# Altium schematic sheet Fujin_Main.SchDoc
size A4; SheetNumber: 1; SheetTotal: 4
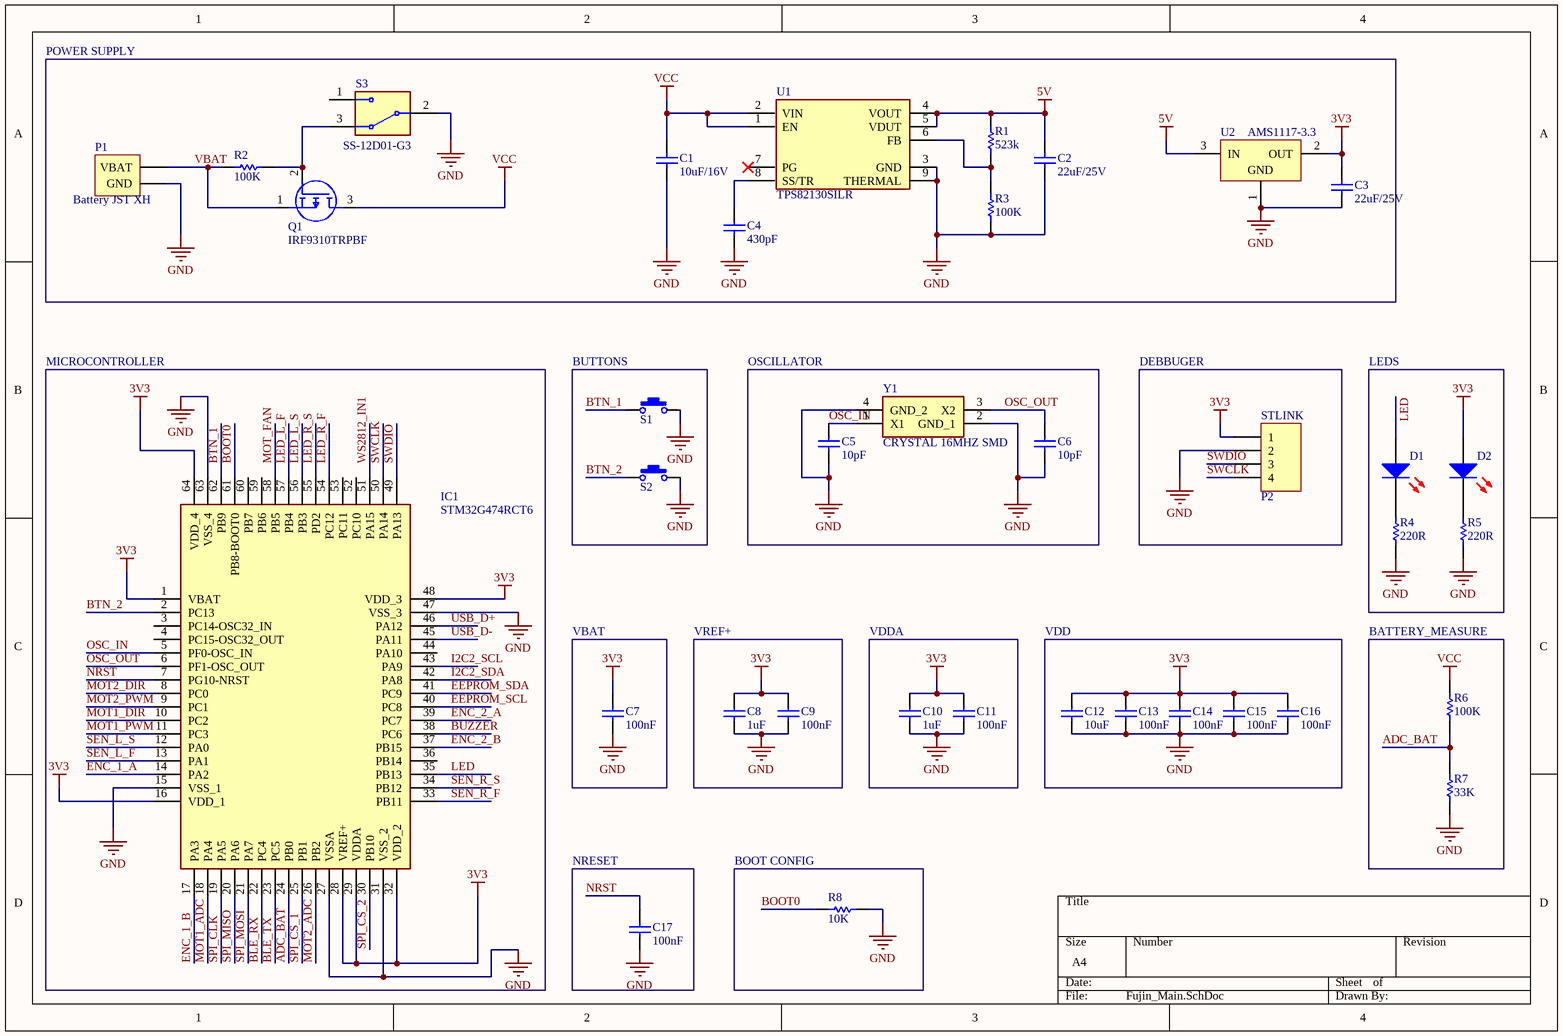
[diagram p0: Fujin_Main.SchDoc]

## Parts
C1  10uF/16V  [CAPACITOR-0805]
C2  22uF/25V  [CAPACITOR-0805]
C3  22uF/25V  [CAPACITOR-0805]
C4  430pF  [Capacitor-0603]
C5  10pF  [CAP 0402]
C6  10pF  [CAP 0402]
C7  100nF  [CAP 0402]
C8  1uF  [Capacitor-0603]
C9  100nF  [CAP 0402]
C10  1uF  [Capacitor-0603]
C11  100nF  [CAP 0402]
C12  10uF  [CAPACITOR-0805]
C13  100nF  [CAP 0402]
C14  100nF  [CAP 0402]
C15  100nF  [CAP 0402]
C16  100nF  [CAP 0402]
C17  100nF  [CAP 0402]
D1  LED RED 0603  [LED 0603]  (value not drawn)
D2  LED RED 0603  [LED 0603]  (value not drawn)
IC1  STM32G474RCT6  [QFP50P1200X1200X160-64N]
P1  Battery JST XH  [JST XH 1x2 Straight]
P2  Header 1x4  [HDR MALE 1x4]  (value not drawn)
Q1  IRF9310TRPBF  [IRF9310TRPBF]
R1  523k  [RESISTOR 0603]
R2  100K  [RESISTOR 0603]
R3  100K  [RESISTOR 0603]
R4  220R  [RESISTOR 0603]
R5  220R  [RESISTOR 0603]
R6  100K  [RESISTOR 0603]
R7  33K  [RESISTOR 0603]
R8  10K  [RESISTOR 0402]
S1  SPST-NO  [B3U-1000P]  (value not drawn)
S2  SPST-NO  [B3U-1000P]  (value not drawn)
S3  SS-12D01-G3  [DEALON SS-12D01-G3]
U1  TPS82130SILR  [SIL0008D]
U2  AMS1117-3.3  [SOT223 - AMS1117]
Y1  CRYSTAL 16MHZ SMD  [ABM10W240000MHZ8K1ZT3]

## Blocks framed on the sheet
POWER SUPPLY: C1-C4 P1 Q1 R1-R3 S3 U1 U2
MICROCONTROLLER: IC1
BUTTONS: S1 S2
OSCILLATOR: C5 C6 Y1
LEDS: D1 D2 R4 R5
VBAT: C7
VREF+: C8 C9
VDDA: C10 C11
VDD: C12-C16
BATTERY_MEASURE: R6 R7
NRESET: C17
BOOT CONFIG: R8

## Nets
3V3: C3.2 C7.2 C8.2 C9.2 C10.2 C11.2 C12.2 C13.2 C14.2 C15.2 C16.2 D2.1(A) IC1.1(VBAT) IC1.16(VDD_1) IC1.28(VREF+) IC1.29(VDDA) IC1.32(VDD_2) IC1.48(VDD_3) IC1.64(VDD_4) P2.1 U2.2(OUT)
5V: C2.2 R1.2 U1.4(VOUT) U1.5(VDUT) U2.3(IN)
GND: C1.1 C2.1 C3.1 C4.1 C5.1 C6.1 C7.1 C8.1 C9.1 C10.1 C11.1 C12.1 C13.1 C14.1 C15.1 C16.1 C17.1 IC1.15(VSS_1) IC1.27(VSSA) IC1.31(VSS_2) IC1.47(VSS_3) IC1.63(VSS_4) P1.2(GND) P2.2 R3.1 R4.1 R5.1 R7.1 R8.2 S1.2 S2.2 S3.2(COM) U1.3(GND) U1.9(THERMAL) U2.1(GND) Y1.2(GND_1) Y1.4(GND_2)
VCC: C1.2 Q1.3(D) R6.2 U1.1(EN) U1.2(VIN)
ADC_BAT: IC1.24(PB0) R6.1 R7.2
BLE_RX: IC1.22(PC4)
BLE_TX: IC1.23(PC5)
BOOT0: IC1.61(PB8-BOOT0) R8.1
BTN_1: IC1.62(PB9) S1.1
BTN_2: IC1.2(PC13) S2.1
BUZZER: IC1.38(PC6)
EEPROM_SCL: IC1.40(PC8)
EEPROM_SDA: IC1.41(PC9)
ENC_1_A: IC1.14(PA2)
ENC_1_B: IC1.17(PA3)
ENC_2_A: IC1.39(PC7)
ENC_2_B: IC1.37(PB15)
I2C2_SCL: IC1.43(PA9)
I2C2_SDA: IC1.42(PA8)
LED: D1.1(A) IC1.35(PB13)
LED_L_F: IC1.57(PB4)
LED_L_S: IC1.56(PB3)
LED_R_F: IC1.54(PC12)
LED_R_S: IC1.55(PD2)
MOT1_ADC: IC1.18(PA4)
MOT1_DIR: IC1.10(PC2)
MOT1_PWM: IC1.11(PC3)
MOT2_ADC: IC1.26(PB2)
MOT2_DIR: IC1.8(PC0)
MOT2_PWM: IC1.9(PC1)
MOT_FAN: IC1.58(PB5)
NRST: C17.2 IC1.7(PG10-NRST)
OSC_IN: C5.2 IC1.5(PF0-OSC_IN) Y1.1(X1)
OSC_OUT: C6.2 IC1.6(PF1-OSC_OUT) Y1.3(X2)
SEN_L_F: IC1.13(PA1)
SEN_L_S: IC1.12(PA0)
SEN_R_F: IC1.33(PB11)
SEN_R_S: IC1.34(PB12)
SPI_CLK: IC1.19(PA5)
SPI_CS_1: IC1.25(PB1)
SPI_CS_2: IC1.30(PB10)
SPI_MISO: IC1.20(PA6)
SPI_MOSI: IC1.21(PA7)
SWCLK: IC1.50(PA14) P2.4
SWDIO: IC1.49(PA13) P2.3
USB_D+: IC1.46(PA12)
USB_D-: IC1.45(PA11)
VBAT: P1.1(VBAT) Q1.1(S) R2.1
WS2812_IN1: IC1.51(PA15)
NetC4_2: C4.2 U1.8(SS/TR)
NetD1_2: D1.2(K) R4.2
NetD2_2: D2.2(K) R5.2
NetQ1_2: Q1.2(G) R2.2 S3.3(NO)
NetR1_1: R1.1 R3.2 U1.6(FB)

Not connected (* = marked no-connect by the designer): IC1 3(PC14-OSC32_IN) 4(PC15-OSC32_OUT) 36(PB14) 44(PA10) 52(PC10) 53(PC11) 59(PB6) 60(PB7); S3 1(NC); U1 7(PG)*

## Notes on the sheet
- DEBBUGER
- (near P2) STLINK

## Library data of the parts
C1 C12 = CAP CER 10UF 16V X5R 0805: Manufacturer: AVX Corporation; Manufacturer Part Number: 0805YD106KAT2A; Capacitance: 10µF; Tolerance: ±10%; Supplier 1: Digi-Key; RoHS: RoHS Compliant; Category: Capacitors; Stock 1: 198871; Pricing 1: 1=0.18, 10=0.124, 25=0.0908, 50=0.0742, 100=0.0627, 250=0.05116, 500=0.0429, 1000=0.03795 (USD); Packaging: Cut Tape (CT); Part Status: Active; Voltage - Rated: 16V; Temperature Coefficient: X5R; Mounting Type: Surface Mount, MLCC; Operating Temperature: -55°C ~ 85°C; Applications: General Purpose; Ratings: -; Package / Case: 0805 (2012 Metric); Size / Dimension: 0.079" L x 0.049" W (2.01mm x 1.25mm); Height - Seated (Max): -; Thickness (Max): 0.055" (1.40mm); Lead Spacing: -; Features: -; Lead Style: -; ComponentLink1URL: http://datasheets.avx.com/cx5r.pdf; ComponentLink1Description: http://datasheets.avx.com/cx5r.pdf; Supplier Part Number 1: 478-5165-1-ND
C2 C3 = CAP CER 22UF 25V X5R 0805: Manufacturer: AVX Corporation; Manufacturer Part Number: 0805YD106KAT2A; Capacitance: 10µF; Tolerance: ±10%; Voltage - Rated: 16V; Supplier 1: Digi-Key; RoHS: RoHS Compliant; Category: Capacitors; Stock 1: 198871; Pricing 1: 1=0.18, 10=0.124, 25=0.0908, 50=0.0742, 100=0.0627, 250=0.05116, 500=0.0429, 1000=0.03795 (USD); Packaging: Cut Tape (CT); Part Status: Active; Temperature Coefficient: X5R; Mounting Type: Surface Mount, MLCC; Operating Temperature: -55°C ~ 85°C; Applications: General Purpose; Ratings: -; Package / Case: 0805 (2012 Metric); Size / Dimension: 0.079" L x 0.049" W (2.01mm x 1.25mm); Height - Seated (Max): -; Thickness (Max): 0.055" (1.40mm); Lead Spacing: -; Features: -; Lead Style: -; ComponentLink1URL: https://www.lcsc.com/product-detail/Multilayer-Ceramic-Capacitors-MLCC-SMD-SMT_Murata-Electronics-GRM21BR61E226ME44L_C86816.html; ComponentLink1Description: http://datasheets.avx.com/cx5r.pdf; Supplier Part Number 1: 478-5165-1-ND
C4 = CAP 430pF: Capacitor Cer 430pF; Manufacturer Part Number: IMP14925; Product Range: MCFY Series; Capacitance Tolerance: +80%, -20%; Dielectric Characteristic: Y5; Voltage Rating: 50; Capacitor Terminals: Radial Leaded; SVHC: No SVHC (15-Jun-2015); Supplier 1: Mult Comercial; Manufacturer: -; RoHS: YES; Stock 1: 115809; Pricing 1: 1=0.10 (BRL); Packaging: Each; Lead Spacing: 5; Operating Temperature Min: -25; Operating Temperature Max: 85; Capacitance Tolerance ±: +80%, -20%; Operating Temperature Range: -25°C to +85°C<!--FANDB--><div class="features-and-benefits-container"><div class="features-and-benefits-description"><span class="features-benefits-value">The MCFY series from Multicomp are radial leaded ceramic disc capacitors. The capacitance values ranges from 6800pF to 0.22?F.</span></div><div class="features-and-benefits-list"><ul class="features-and-benefits-list-list"><li class="features-and-benefits-list-item">Large capacitance in small size</li><li class="features-and-benefits-list-item">Rated voltage of 50V</li><li class="features-and-benefits-list-item">80%/-20% tolerance</li><li class="features-and-benefits-list-item">Operating temperature range -25°C to +85; ComponentLink1URL: http://loja.multcomercial.com.br/capacitor-ceramico-disco-100kpf-50v-104-100k-100nf-0-1uf-cod-1351.html; ComponentLink1Description: http://loja.multcomercial.com.br/capacitor-ceramico-disco-100kpf-50v-104-100k-100nf-0-1uf-cod-1351.html; Supplier Part Number 1: Capacitor Cerâmico Disco 100Kpf/50V (104/100K/100nF/0.1uF) cód. 1351
C5 C6 = CAP 10pF: Capacitor Cer 10pF; Manufacturer Part Number: IMP14925; Product Range: MCFY Series; Capacitance Tolerance: +80%, -20%; Dielectric Characteristic: Y5; Voltage Rating: 50; Capacitor Terminals: Radial Leaded; SVHC: No SVHC (15-Jun-2015); Supplier 1: Mult Comercial; Manufacturer: -; RoHS: YES; Stock 1: 115809; Pricing 1: 1=0.10 (BRL); Packaging: Each; Lead Spacing: 5; Operating Temperature Min: -25; Operating Temperature Max: 85; Capacitance Tolerance ±: +80%, -20%; Operating Temperature Range: -25°C to +85°C<!--FANDB--><div class="features-and-benefits-container"><div class="features-and-benefits-description"><span class="features-benefits-value">The MCFY series from Multicomp are radial leaded ceramic disc capacitors. The capacitance values ranges from 6800pF to 0.22?F.</span></div><div class="features-and-benefits-list"><ul class="features-and-benefits-list-list"><li class="features-and-benefits-list-item">Large capacitance in small size</li><li class="features-and-benefits-list-item">Rated voltage of 50V</li><li class="features-and-benefits-list-item">80%/-20% tolerance</li><li class="features-and-benefits-list-item">Operating temperature range -25°C to +85; ComponentLink1URL: http://loja.multcomercial.com.br/capacitor-ceramico-disco-100kpf-50v-104-100k-100nf-0-1uf-cod-1351.html; ComponentLink1Description: http://loja.multcomercial.com.br/capacitor-ceramico-disco-100kpf-50v-104-100k-100nf-0-1uf-cod-1351.html; Supplier Part Number 1: Capacitor Cerâmico Disco 100Kpf/50V (104/100K/100nF/0.1uF) cód. 1351
C7 C9 C11 C13-C17 = CAP 100NF 50V 0402: Capacitor Cer 100nF 50V 0402; Manufacturer Part Number: IMP14925; Product Range: MCFY Series; Capacitance: 0.1uF; Capacitance Tolerance: +80%, -20%; Dielectric Characteristic: Y5; Voltage Rating: 50; Capacitor Terminals: Radial Leaded; SVHC: No SVHC (15-Jun-2015); Supplier 1: Mult Comercial; Manufacturer: -; RoHS: YES; Stock 1: 115809; Pricing 1: 1=0.10 (BRL); Packaging: Each; Lead Spacing: 5; Operating Temperature Min: -25; Operating Temperature Max: 85; Capacitance Tolerance ±: +80%, -20%; Operating Temperature Range: -25°C to +85°C<!--FANDB--><div class="features-and-benefits-container"><div class="features-and-benefits-description"><span class="features-benefits-value">The MCFY series from Multicomp are radial leaded ceramic disc capacitors. The capacitance values ranges from 6800pF to 0.22?F.</span></div><div class="features-and-benefits-list"><ul class="features-and-benefits-list-list"><li class="features-and-benefits-list-item">Large capacitance in small size</li><li class="features-and-benefits-list-item">Rated voltage of 50V</li><li class="features-and-benefits-list-item">80%/-20% tolerance</li><li class="features-and-benefits-list-item">Operating temperature range -25°C to +85; ComponentLink1URL: http://loja.multcomercial.com.br/capacitor-ceramico-disco-100kpf-50v-104-100k-100nf-0-1uf-cod-1351.html; ComponentLink1Description: http://loja.multcomercial.com.br/capacitor-ceramico-disco-100kpf-50v-104-100k-100nf-0-1uf-cod-1351.html; Supplier Part Number 1: Capacitor Cerâmico Disco 100Kpf/50V (104/100K/100nF/0.1uF) cód. 1351
C8 C10 = CAP CER 1UF 50V 0603: Multilayer Ceramic Capacitors MLCC - SMD/SMT 1uF 50Volts X5R +/-10% 0603 STD; Manufacturer: Taiyo Yuden; Manufacturer Part Number: UMK107BJ105KA-T; Tolerance: 10 %; Type: Industrial/Automotive and Safety; Voltage Rating DC: 50 VDC; Class: Class 2; Qualification: AEC-Q200; Supplier 1: Mouser; RoHS: RoHS Compliant; Category: Multilayer Ceramic Capacitors MLCC - SMD/SMT; Stock 1: 123303; Pricing 1: 1=0.512, 10=0.187, 100=0.101, 500=0.072, 1000=0.053, 4000=0.053, 8000=0.038, 12000=0.034, 24000=0.032 (AUD); Capacitance: 1 uF; Height: 0.8 mm; Length: 1.6 mm; Package / Case: 0603 (1608 metric); Packaging: Reel; Product: General Type MLCCs; Series: M; Termination Style: SMD/SMT; Width: 0.8 mm; Brand: Taiyo Yuden; Case Code - in: 0603; Case Code - mm: 1608; Dielectric: X5R; Maximum Operating Temperature: + 85 C; Minimum Operating Temperature: - 55 C; Termination: -; RoHS - Mouser: Y; Minimum Order Quantity: 1; Reeling: True; ComponentLink1URL: http://www.mouser.com/ds/2/396/mlcc_all_e-541559.pdf; ComponentLink1Description: http://www.mouser.com/ds/2/396/mlcc_all_e-541559.pdf; Supplier Part Number 1: 1uF
D1 D2 = LED RED 0603: LED; Manufacturer_Name: ROHM Semiconductor; Manufacturer_Part_Number: SML-D12U1WT86; Datasheet Link: https://componentsearchengine.com/Datasheets/1/SML-D12U1WT86.pdf; Height: 0.65mm; Mouser Part Number: 755-SML-D12U1WT86; Mouser Price/Stock: https://www.mouser.co.uk/ProductDetail/ROHM-Semiconductor/SML-D12U1WT86?qs=M3jcYzEJUdEySuGkbjHEtQ%3D%3D
IC1 = STM32G474RCT6: Integrated Circuit; Manufacturer_Name: STMicroelectronics; Datasheet Link: https://www.mouser.it/datasheet/2/389/dm00431551-1799305.pdf; Height: 1.6mm; Manufacturer_Part_Number: STM32G474RCT6; Mouser Part Number: 511-STM32G474RCT6; Mouser Price/Stock: https://www.mouser.co.uk/ProductDetail/STMicroelectronics/STM32G474RCT6?qs=uwxL4vQweFOU%2FtVbMPY7ow%3D%3D
P1 = Battery Connector
P2 = Header 1x4: Headers & Wire Housings 40Pin 2mm Spacing Single Row Hdrs, 5pc; Manufacturer: Cromax; Manufacturer Part Number: IMP10327; Mounting Angle: Vertical; Number of Positions: 40 Position; Supplier 1: Mult Comercial; RoHS: RoHS Compliant; Category: Headers & Wire Housings; Stock 1: 14; Pricing 1: 1=1.00, 5=0.20 (BRL); Accessory Type: -; Contact Plating: Gold; Contact Type: -; Number of Rows: 1 Row; Product: Headers; Termination Style: Through Hole; Type: Breakaway; Brand: Cromax; Mounting Style: Straight Pin; Pitch: 2 mm; Row Spacing: -; Contact Gender: Pin (Male); Product Category: Accessories; RoHS - Mouser: Y; Minimum Order Quantity: 1; Reeling: False; ComponentLink1URL: http://loja.multcomercial.com.br/barra-de-pinos-simples-1x40-macho-bmo40-1e.html; ComponentLink1Description: http://loja.multcomercial.com.br/barra-de-pinos-simples-1x40-macho-bmo40-1e.html; Supplier Part Number 1: Barra de Pinos Simples 1x40 Macho BMO40-1E
Q1 = IRF9310TRPBF: MOSFET (P-Channel); Manufacturer_Name: Infineon; Datasheet Link: http://uk.rs-online.com/web/p/products/8273912; Height: 1.75mm; Manufacturer_Part_Number: IRF9310TRPBF; Mouser Part Number: 942-IRF9310TRPBF; Mouser Price/Stock: https://www.mouser.co.uk/ProductDetail/Infineon-Technologies/IRF9310TRPBF?qs=9%252BKlkBgLFf0NoechZyOTDg%3D%3D; Arrow Part Number: IRF9310TRPBF; Arrow Price/Stock: https://www.arrow.com/en/products/irf9310trpbf/infineon-technologies-ag
R1 = RES 523K 1%: ComponentLink1URL: http://www.farnell.com/datasheets/1678796.pdf; ComponentLink1Description: http://www.farnell.com/datasheets/1678796.pdf; Category: Resistors; Resistance (Ohms): 523k; ComponentLink2URL: http://industrial.panasonic.com/www-cgi/jvcr13pz.cgi?E+PZ+3+AOA0001+ERJ3GEYJ103V+7+WW; ComponentLink2Description: http://industrial.panasonic.com/www-cgi/jvcr13pz.cgi?E+PZ+3+AOA0001+ERJ3GEYJ103V+7+WW
R2 = RES 100K 5%: ComponentLink1URL: http://www.farnell.com/datasheets/1678796.pdf; ComponentLink1Description: http://www.farnell.com/datasheets/1678796.pdf; Category: Resistors; Resistance (Ohms): 100k; ComponentLink2URL: http://industrial.panasonic.com/www-cgi/jvcr13pz.cgi?E+PZ+3+AOA0001+ERJ3GEYJ103V+7+WW; ComponentLink2Description: http://industrial.panasonic.com/www-cgi/jvcr13pz.cgi?E+PZ+3+AOA0001+ERJ3GEYJ103V+7+WW
R3 R6 = RES 100K 1%: ComponentLink1URL: http://www.farnell.com/datasheets/1678796.pdf; ComponentLink1Description: http://www.farnell.com/datasheets/1678796.pdf; Category: Resistors; Resistance (Ohms): 100k; ComponentLink2URL: http://industrial.panasonic.com/www-cgi/jvcr13pz.cgi?E+PZ+3+AOA0001+ERJ3GEYJ103V+7+WW; ComponentLink2Description: http://industrial.panasonic.com/www-cgi/jvcr13pz.cgi?E+PZ+3+AOA0001+ERJ3GEYJ103V+7+WW
R4 R5 = RES 220R 5%_1: Manufacturer: Ty-Ohm; Manufacturer Part Number: CR25; Tolerance: ±5%; Power (Watts): 0.25W, 1/4W; Temperature Coefficient: 0/ -500ppm/°C; Resistance (Ohms): 470R; Supplier 1: Mult Comercial; RoHS: RoHS Compliant; Category: Resistors; Stock 1: 617543; Pricing 1: 1=0.20 (BRL); Packaging: Cut Tape (CT); Composition: Carbon Film; Features: Flame Retardant Coating, Safety; Operating Temperature: -55°C ~ 155°C; Package / Case: Axial; Supplier Device Package: Axial; Size / Dimension: 0.091" Dia x 0.256" L (2.30mm x 6.50mm); Height: -; Number of Terminations: 2; ComponentLink1URL: http://loja.multcomercial.com.br/resistor-de-1-4-de-watt-cr25-5-de-tolerancia.html; ComponentLink1Description: http://loja.multcomercial.com.br/resistor-de-1-4-de-watt-cr25-5-de-tolerancia.html; Supplier Part Number 1: Resistor de Filme de Carbono 1/4 de Watt CR25 5% de tolerância - 0.22R Ω à 10M Ω
R7 = RES 33K 1%: ComponentLink1URL: http://www.farnell.com/datasheets/1678796.pdf; ComponentLink1Description: http://www.farnell.com/datasheets/1678796.pdf; ComponentLink2URL: http://industrial.panasonic.com/www-cgi/jvcr13pz.cgi?E+PZ+3+AOA0001+ERJ3GEYJ103V+7+WW; ComponentLink2Description: http://industrial.panasonic.com/www-cgi/jvcr13pz.cgi?E+PZ+3+AOA0001+ERJ3GEYJ103V+7+WW
R8 = RES 10K 5%: Manufacturer: PANASONIC ELECTRONIC COMPONENTS; Manufacturer Part Number: ERJ-3GEYJ103V; Tolerance: ±5%; Power (Watts): 0.1W, 1/10W; Temperature Coefficient: ±200ppm/°C; RoHS: YES; ComponentLink1URL: http://www.farnell.com/datasheets/1678796.pdf; ComponentLink1Description: http://www.farnell.com/datasheets/1678796.pdf; Category: Resistors; Packaging: Tape & Reel (TR); Resistance (Ohms): 10k; Composition: Thick Film; Features: Automotive AEC-Q200; Operating Temperature: -55°C ~ 155°C; Package / Case: 0603 (1608 Metric); Supplier Device Package: 0603; Size / Dimension: 0.063" L x 0.031" W (1.60mm x 0.80mm); Height: 0.022" (0.55mm); Number of Terminations: 2; ComponentLink2URL: http://industrial.panasonic.com/www-cgi/jvcr13pz.cgi?E+PZ+3+AOA0001+ERJ3GEYJ103V+7+WW; ComponentLink2Description: http://industrial.panasonic.com/www-cgi/jvcr13pz.cgi?E+PZ+3+AOA0001+ERJ3GEYJ103V+7+WW
S1 S2 = Switch Tactile B3U-1000P: Manufacturer: Omron; Supplier 1: Digi-Key; ComponentLink1URL: https://br.mouser.com/ProductDetail/Omron-Electronics/B3U-1000P?qs=AO7BQMcsEu4ip80xyf2FwA%3D%3D; ComponentLink1Description: http://industrial.panasonic.com/cdbs/www-data/pdf/ATK0000/ATK0000CE10.pdf
S3 = 1101M2S3CGE2: Switch; Manufacturer_Name: C & K COMPONENTS; Alternate Part Number: XKB Connection SS-12D10L5; Datasheet Link: https://www.ckswitches.com/media/1429/1000.pdf; Height: 11.43mm; Manufacturer_Part_Number: 1101M2S3CGE2; Mouser Part Number: 611-1101M2S3CGE2; Mouser Price/Stock: https://www.mouser.co.uk/ProductDetail/CK/1101M2S3CGE2?qs=lwH5WijZ8ehN3XG160Un%2Fg%3D%3D; Arrow Part Number: 1101M2S3CGE2; Arrow Price/Stock: https://www.arrow.com/en/products/1101m2s3cge2/ck; Alternate Link: https://www.lcsc.com/product-detail/Slide-Switches_XKB-Connection-SS-12D10L5_C319012.html; LCSC Part: C319012
U1 = TPS82130SILR: Undefined or Miscellaneous; Manufacturer_Name: Texas Instruments; Datasheet Link: http://www.ti.com/lit/gpn/tps82130; Manufacturer_Part_Number: TPS82130SILR; Mouser Part Number: 595-TPS82130SILR; Mouser Price/Stock: https://www.mouser.co.uk/ProductDetail/Texas-Instruments/TPS82130SILR?qs=diC8vqfyxkoyC4Q%252BBNy%2FPA%3D%3D; Arrow Part Number: TPS82130SILR; Arrow Price/Stock: https://www.arrow.com/en/products/tps82130silr/texas-instruments?region=europe
Y1 = CRYSTAL 16MHZ SMD: CRYSTAL 16MHZ; Manufacturer_Name: ABRACON; Manufacturer_Part_Number: ABM10W-16.0000MHZ-4-B1U-T3; Datasheet Link: https://www.abracon.com/Resonators/ABM10W.pdf; Height: 0.6mm; Mouser Part Number: 815-10W16-4B1UT; Mouser Price/Stock: https://www.mouser.co.uk/ProductDetail/ABRACON/ABM10W-16.0000MHZ-4-B1U-T3?qs=5aG0NVq1C4x2nD%252BLlu9wCg%3D%3D; Arrow Part Number: ABM10W-16.0000MHZ-4-B1U-T3; Arrow Price/Stock: https://www.arrow.com/en/products/abm10w-16.0000mhz-4-b1u-t3/abracon?region=nac